# Altium schematic sheet 09-other.SchDoc
size A4
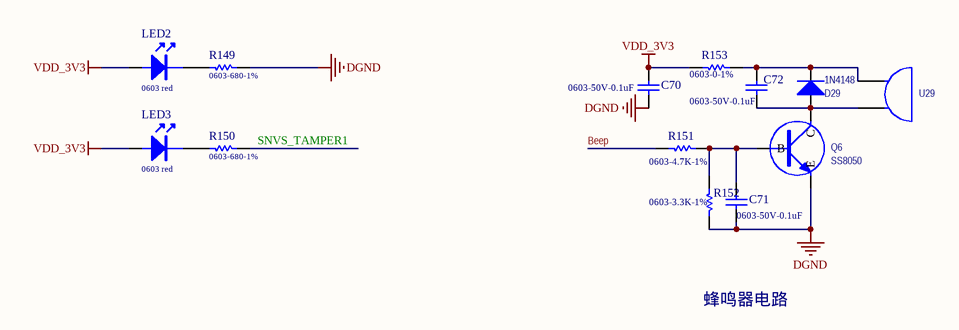
[diagram p0: 09-other.SchDoc]

## Parts
C70  0603-50V-0.1uF  [0603C]
C71  0603-50V-0.1uF  [0603C]
C72  0603-50V-0.1uF  [0603C]
D29  1N4148  [SOD-323]
LED2  0603 red  [LED_1]
LED3  0603 red  [LED_1]
Q6  SS8050  [SOT-23]
R149  0603-680-1%  [0603R]
R150  0603-680-1%  [0603R]
R151  0603-4.7K-1%  [0603R]
R152  0603-3.3K-1%  [0603R]
R153  0603-0-1%  [0603R]
U29  BUZZER  [B-12*9.5]  (value not drawn)

## Nets
DGND: C70.2 C71.2 Q6.2(E) R149.1 R152.1
VDD_3V3: C70.1 LED2.1 LED3.1 R153.2
Beep: R151.1
SNVS_TAMPER1: R150.1
NetC71_1: C71.1 Q6.1(B) R151.2 R152.2
NetC72_1: C72.1 D29.2(K) R153.1 U29.1(A)
NetC72_2: C72.2 D29.1(A) Q6.3(C) U29.2(B)
NetLED2_2: LED2.2 R149.2
NetLED3_2: LED3.2 R150.2

## Notes on the sheet
- 蜂鸣器电路

## Library data of the parts
C70-C72 = Cap: Capacitor; Value: 10nF; Published: 8-Jun-2000; Revision: July-2002: Re-released for DXP Platform.; Publisher: Altium Limited
D29 = Diode 1N4148: High Conductance Fast Diode; Published: 8-Jun-2000; LatestRevisionDate: 17-Jul-2002; LatestRevisionNote: Re-released for DXP Platform.; DatasheetVersion: 1997; PackageReference: DO-35; Publisher: Altium Limited; Code_JEDEC: DO-204-AH; ComponentLink1Description: Manufacturer Link; ComponentLink1URL: http://www.fairchildsemi.com/; ComponentLink2Description: Datasheet; ComponentLink2URL: http://www.fairchildsemi.com/ds/1N%2F1N4148.pdf
LED2 LED3 = LED: SY: POW
Q6 = NPN: NPN Transistor
R149-R153 = Res1: Resistor; Value: 1K; Published: 8-Jun-2000; LatestRevisionDate: 17-Jul-2002; LatestRevisionNote: Re-released for DXP Platform.; PackageReference: AXIAL-0.3; Publisher: Altium Limited
U29 = BUZZER: TMB12A03